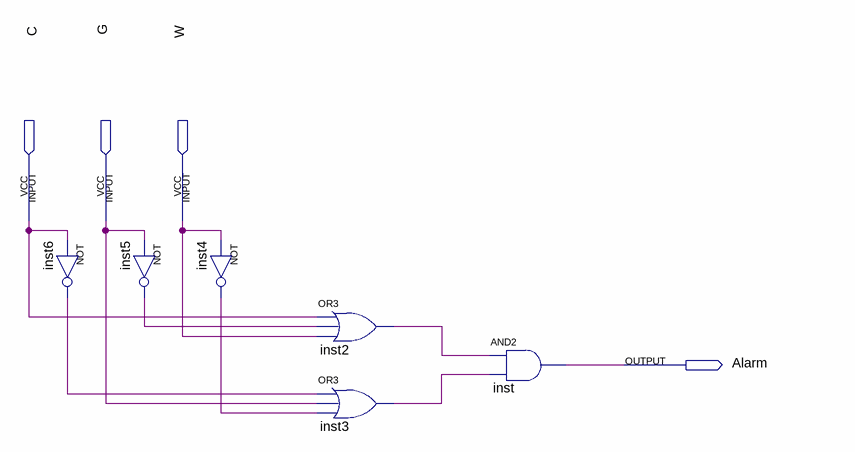
[diagram p0: schematic sheet]
// Quartus schematic lab3step0.bdf as structural Verilog: 6 symbols, 4 pins
module lab3step0 (
  input  C,
  input  G,
  input  W,
  output Alarm
);

  wire inst2_out, inst3_out, inst4_out, inst5_out, inst6_out;

  not inst6 (inst6_out, C);
  not inst5 (inst5_out, G);
  not inst4 (inst4_out, W);
  or inst2 (inst2_out, C, inst5_out, W);
  or inst3 (inst3_out, inst6_out, G, inst4_out);
  and inst (Alarm, inst2_out, inst3_out);
endmodule
